# Altium schematic sheet Power.SchDoc
size A; SheetNumber: 3; SheetTotal: 5
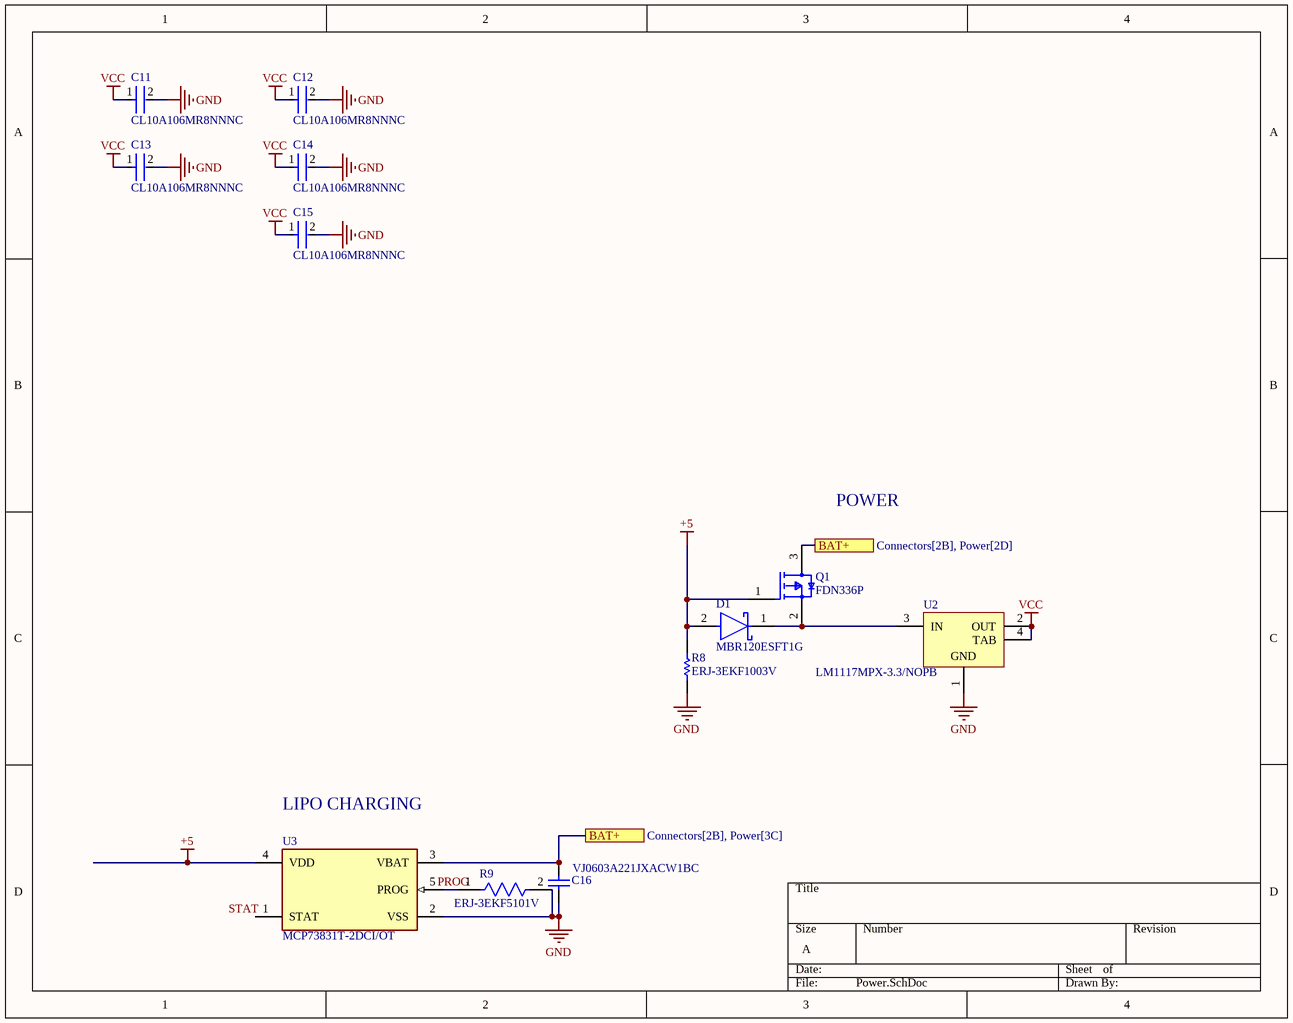
[diagram p0: Power.SchDoc]

## Parts
C11  CL10A106MR8NNNC  [FP-CL10-IPC_C]
C12  CL10A106MR8NNNC  [FP-CL10-IPC_C]
C13  CL10A106MR8NNNC  [FP-CL10-IPC_C]
C14  CL10A106MR8NNNC  [FP-CL10-IPC_C]
C15  CL10A106MR8NNNC  [FP-CL10-IPC_C]
C16  VJ0603A221JXACW1BC  [CAPC1608X95X40ML15T15]
D1  MBR120ESFT1G  [On_Semiconductor_498_MFG]
Q1  FDN336P  [FP-527AG-IPC_A]
R8  ERJ-3EKF1003V  [RESC1608X55X30ML15T15]
R9  ERJ-3EKF5101V  [FP-ERJ3EK-MFG]
U2  LM1117MPX-3.3/NOPB  [DCY0004A_L]
U3  MCP73831T-2DCI/OT  [FP-C04-091-OT-IPC_B]

## Ports
BAT+ (see Connectors[2B], Power[2D]), BAT+ (see Connectors[2B], Power[3C])

## Nets
+5: D1.2(A) Q1.1(G) R8.2 U3.4(VDD)
GND: C11.2 C12.2 C13.2 C14.2 C15.2 C16.1 R8.1 R9.2 U2.1(GND) U3.2(VSS)
VCC: C11.1 C12.1 C13.1 C14.1 C15.1 U2.2(OUT) U2.4(TAB)
BAT+: C16.2 Q1.3(D) U3.3(VBAT) ; port BAT+
NetD1_1: D1.1(C) Q1.2(S) U2.3(IN)
NetR9_1: R9.1 U3.5(PROG)

Not connected (* = marked no-connect by the designer): U3 1(STAT)

## Notes on the sheet
- POWER
- (near U3) LIPO CHARGING
- Labels drawn without touching a wire or pin: PROG, STAT

## Library data of the parts
C11-C15 = CMP-13271-001990-1: Cap Ceramic 10uF 4V X5R ±20% Pad SMD 0603 +85°C T/R; Thickness: 0.035inch; Dielectric: X5R; Lead Free: Lead Free; Case Code (Imperial): 0603; Height: 0.8mm; Case Code (Metric): 1608; Voltage Rating (DC): 4V; Length: 1.6mm; Voltage Rating: 4V; Min Operating Temperature: -55°C; Depth: 0.8mm; Mount: Surface Mount; Radiation Hardening: No; Case/Package: 0603; Package Quantity: 1; Packaging: Tape and Reel; Width: 0.031inch; Tolerance: 20%; Max Operating Temperature: 85°C; Capacitance: 10uF
C16 = CMP-2006-00030-1: Manufacturer: Vitramon; Part Number: VJ0603A221JXACW1BC
D1 = CMP-1055-00434-2: NexarPartId: 330787; Manufacturer Lifecycle Status: ACTIVE; Voltage Rating (DC): 20V; Max Forward Surge Current (Ifsm): 40A; Output Current: 1A; Max Junction Temperature (Tj): 150°C; Polarity: Standard; Peak Reverse Current: 10µA; Element Configuration: Single; Forward Voltage: 530mV; Lifecycle Status: Production; Packaging: Cut Tape; Lead Free: Lead Free; Radiation Hardening: No; Min Operating Temperature: -65°C; Average Rectified Current: 1A; Current Rating: 1A; Max Reverse Voltage (DC): 20V; RoHS: Compliant; REACH SVHC: No SVHC; Max Surge Current: 40A; Length: 2.9mm; Forward Current: 1A; Height: 880µm; Contact Plating: Tin; Width: 1.8mm; Reverse Voltage: 20V; Schedule B: 8541100080; Peak Non-Repetitive Surge Current: 40A; Max Operating Temperature: 150°C; Max Repetitive Reverse Voltage (Vrrm): 20V; Max Reverse Leakage Current: 10µA; Number of Pins: 2; Halogen Free: Halogen Free
Q1 = CMP-07173-000103-1: MOSFET P-CH 20V 1.3A SSOT3; Voltage Rating (DC): -20V; Element Configuration: Single; Threshold Voltage: -900mV; Current Rating: -1.3A; Rds On Max: 200mR; Turn-Off Delay Time: 16ns; Input Capacitance: 330pF; Max Power Dissipation: 500mW; Rise Time: 12ns; Turn-On Delay Time: 7ns; Number of Elements: 1; Gate to Source Voltage (Vgs): 8V; Width: 1.4mm; Lead Free: Lead Free; Length: 2.92mm; Max Operating Temperature: 150°C; Mount: Surface Mount; Contact Plating: Tin; Radiation Hardening: No; Case/Package: TO-236-3; Weight: 0.03g; Drain to Source Breakdown Voltage: -20V; Continuous Drain Current (ID): 1.3A; Min Operating Temperature: -55°C; On-State Resistance: 200mR; Drain to Source Voltage (Vdss): 20V; Fall Time: 12ns; Drain to Source Resistance: 200mR; Package Quantity: 1; Power Dissipation: 500mW; Nominal Vgs: -900mV; Termination: SMD/SMT; Packaging: Tape and Reel; Number of Pins: 3; Dual Supply Voltage: -20V; REACH SVHC: No SVHC; Height: 0.94mm
R8 = CMP-2000-00182-1: Manufacturer: Panasonic; Part Number: ERJ-3EKF1003V
R9 = CMP-2000-00540-8: RES SMD 5.1K OHM 1% 1/10W 0603; Power Rating: 100mW; Temperature Coefficient: 100ppm/°C; Voltage Rating: 75V; Resistance: 5.1kR; Military Standard: Not; Case/Package: 0603; Packaging: Tape and Reel; Package Quantity: 1; Reach SVHC Compliant: Yes; Lead Free: Lead Free; Mount: Surface Mount; Size Code: 0603; Depth: 0.8mm; Resistance Tolerance: 1%; Number of Terminations: 2; Resistor Type: Thick Film; Width: 0.8mm; Construction: Rectangular; Series: ERJ; Radiation Hardening: No; Max Operating Temperature: 155°C; Features: Automotive AEC-Q200; Tolerance: 1%; Voltage Rating (DC): 75V; Length: 1.6mm; RoHS Compliant: Yes; Min Operating Temperature: -55°C; Case Code (Metric): 1608; Termination: SMD/SMT; Weight: 7.1E-05oz; Max Power Dissipation: 100mW; Contact Plating: Tin; Height: 0.022inch; Case Code (Imperial): 0603
U2 = CMP-0062-01639-4: 800mA Low-Dropout Linear Regulator, 4-pin SOT-223, Pb-Free; Manufacturer: Texas Instruments; High-Reliability: Y; PowerWise: N; PackageTopMarking: XYTT*N05A; CompType: LDO IC; ComponentLink1URL: http://www.ti.com/general/docs/lit/getliterature.tsp?genericPartNumber=LM1117-N&fileType=pdf; PartNumber: LM1117MPX-3.3/NOPB; ComponentLink1Description: Datasheet URL; PinCount: 4; Code_JEDEC: TO-261-AA; PackageDescription: Molded SOT-223, 6.50 x 3.56 x 1.6mm Body, 4 Lead, 2.3mm Pitch; PackageReference: DCY0004A; RoHS: Y; Code_IPC: SOT223-4
U3 = CMP-0133-00146-2: IC CONTROLLR LI-ION 4.2V SOT23-5; Max Charge Current: 500mA; Min Output Voltage: 4.168V; Max Supply Voltage: 6V; Max Output Voltage: 4.232V; Number of Cells: 1; Operating Supply Current: 510uA; Min Supply Voltage: 3.75V; Max Output Current: 500mA; Case/Package: SOT-23; Radiation Hardening: No; REACH SVHC: No SVHC; Package Quantity: 3000; Output Current: 500mA; Number of Channels: 1; Output Voltage: 4.2V; Max Operating Temperature: 85°C; Number of Pins: 5; Mount: Surface Mount; Length: 3.1mm; Contact Plating: Tin; Packaging: Tape and Reel; Width: 1.8mm; Min Operating Temperature: -40°C; Max Input Voltage: 3.75V; Height: 1.3mm; Lead Free: Lead Free